# Altium project Node-IOT.PrjPcb
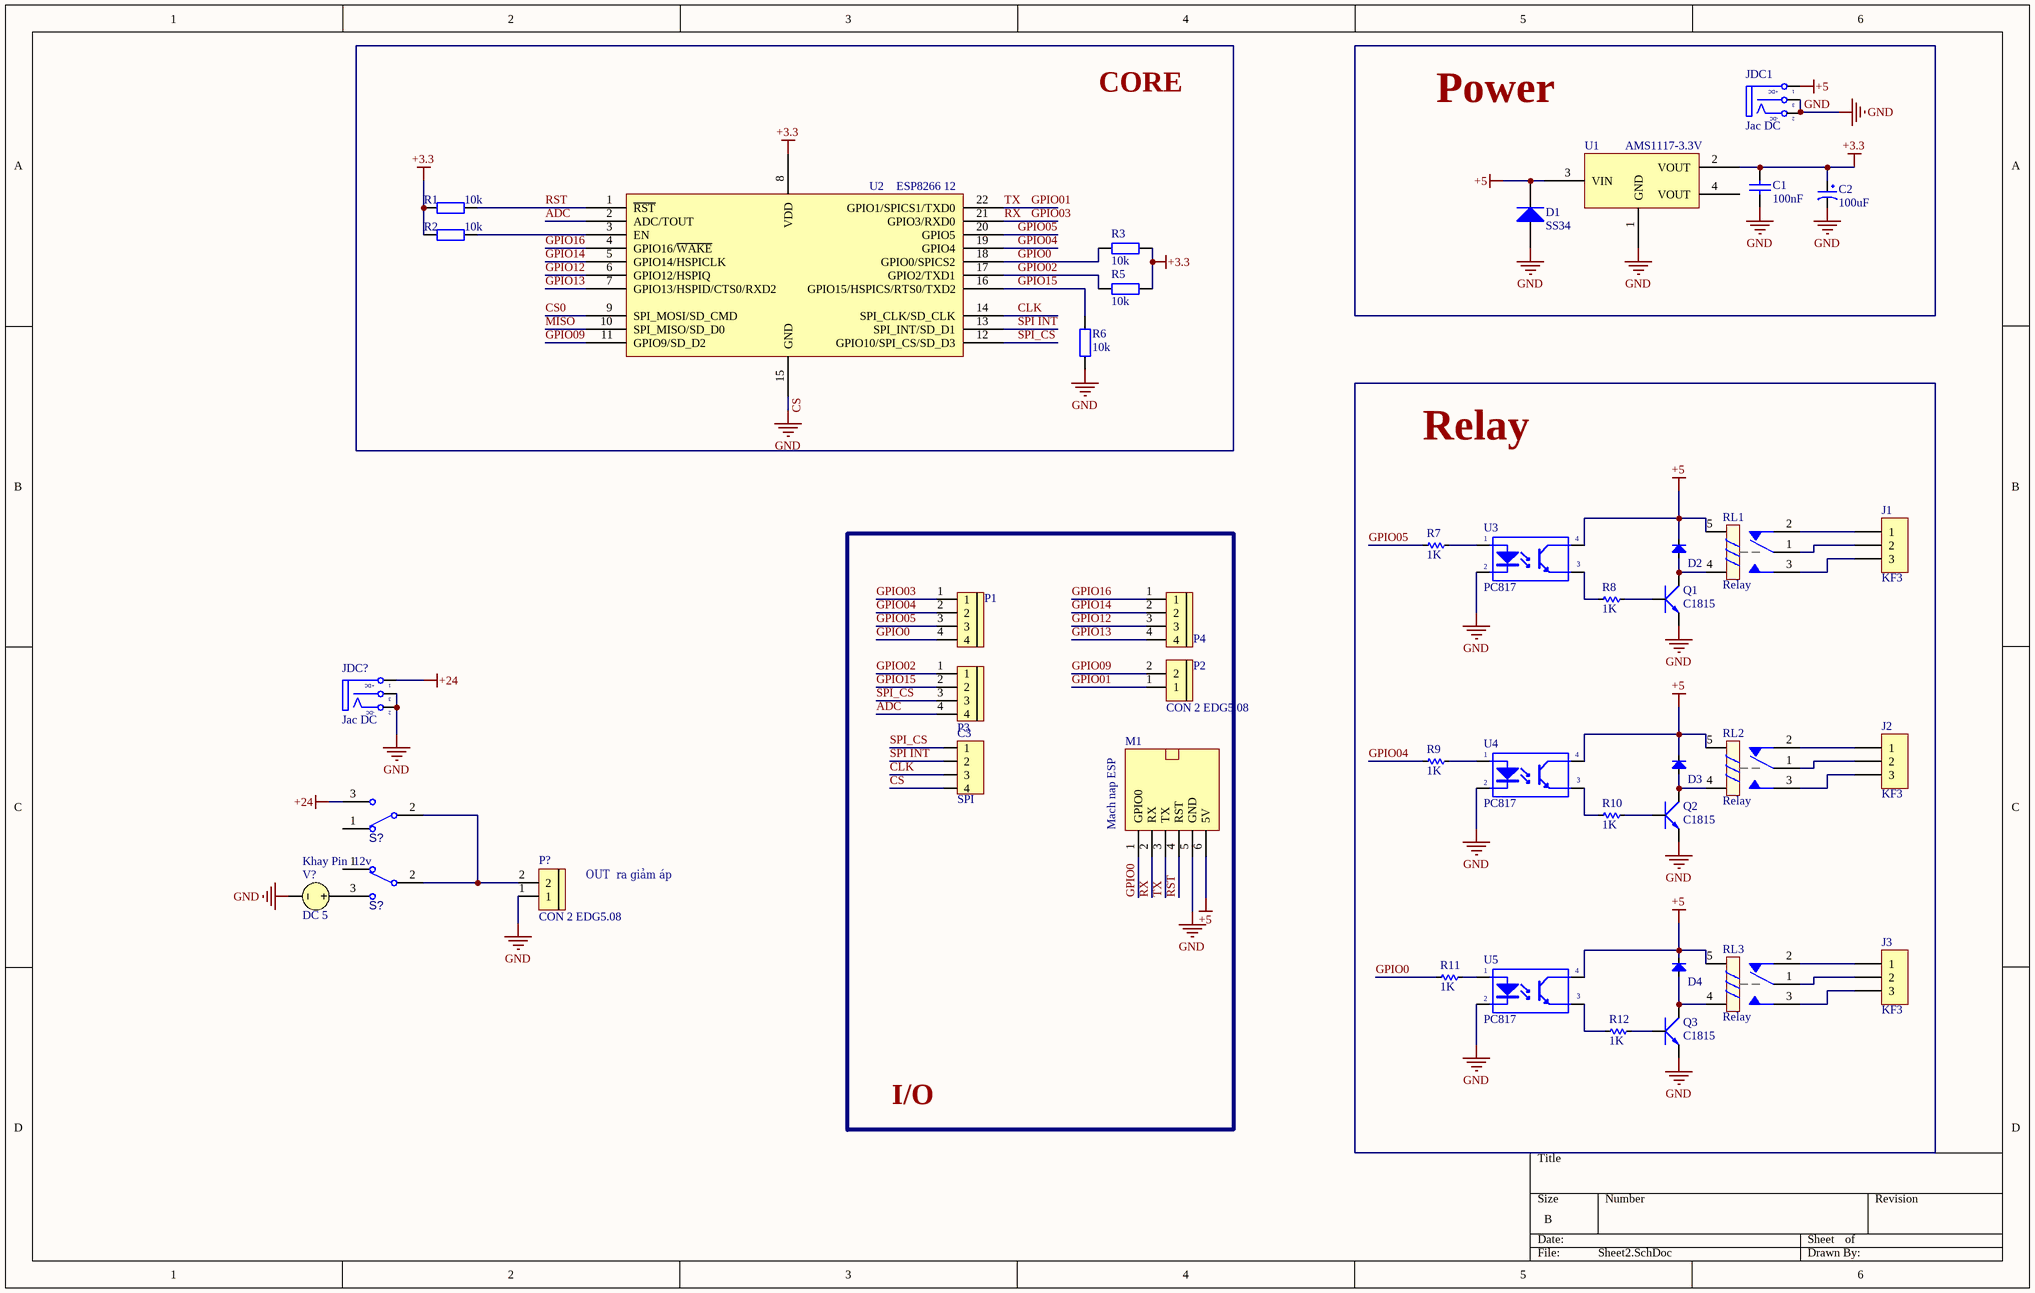
[diagram p0: Sheet2.SchDoc]
1 sheet, 43 parts. Net scope: global (net labels, ports and power ports of the same name join across sheets).
Board file: PCB2.PcbDoc

## Sheet Sheet2.SchDoc
size B; SheetNumber: 1; SheetTotal: 1

### Parts
(Parts that share a designator on the sheet are numbered #1, #2 ... from top to bottom, then left to right.)
C1  100nF  [tu 0805]
C2  100uF  [tu tantalum smd3528]
C3  SPI  [HDR4]
D1  SS34  [DIODE SMA]
D2  Diode  [DIO-1A]  (value not drawn)
D3  Diode  [DIO-1A]  (value not drawn)
D4  Diode  [DIO-1A]  (value not drawn)
J1  KF3  [KF3-5.08]
J2  KF3  [KF3-5.08]
J3  KF3  [KF3-5.08]
JDC1  Jac DC  [DC0]
JDC?  Jac DC  [DC0]
M1  Mach nap ESP  [MACH NAP ESP]
P1  CON 4 EDG5.08  [CON 4 4EDG5.08]  (value not drawn)
P2  CON 4 EDG5.08  [CON 4 4EDG5.08]  (value not drawn)
P3  CON 4 EDG5.08  [CON 4 4EDG5.08]  (value not drawn)
P4  CON 2 EDG5.08  [CON 2 2EDG5.08]
P?  CON 2 EDG5.08  [CON 2 2EDG5.08]
Q1  C1815  [TO92]
Q2  C1815  [TO92]
Q3  C1815  [TO92]
R1  10k  [tro smd 0805]
R2  10k  [tro smd 0805]
R3  10k  [tro smd 0805]
R5  10k  [tro smd 0805]
R6  10k  [tro smd 0805]
R7  1K  [RES-1/2W]
R8  1K  [RES-1/2W]
R9  1K  [RES-1/2W]
R10  1K  [RES-1/2W]
R11  1K  [RES-1/2W]
R12  1K  [RES-1/2W]
RL1  Relay  [Relay 5 Chan SRD]
RL2  Relay  [Relay 5 Chan SRD]
RL3  Relay  [Relay 5 Chan SRD]
S?#1  SW_THD_SPDT  [SWITCH SPDT 1P2T 2mm]  (value not drawn)
S?#2  SW_THD_SPDT  [SWITCH SPDT 1P2T 2mm]  (value not drawn)
U1  AMS1117-3.3V  [SOT223]
U2  ESP8266 12  [ESP8266 12]
U3  PC817  [DIP4]
U4  PC817  [DIP4]
U5  PC817  [DIP4]
V?  DC 5

### Nets
+3.3: C1.1 C2.1 R1.2 R2.2 R3.2 R5.2 U1.2(VOUT) U2.8(VDD)
+5: D1.2(K) D2.2(K) D3.2(K) D4.2(K) JDC1.1(T) M1.6(5V) RL1.5 RL2.5 RL3.5 U1.3(VIN) U3.4(C) U4.4(C) U5.4(C)
+24: JDC?.1(T) S?#1.3
CS: C1.2 C2.2 C3.4 D1.1(A) JDC1.2(TN) JDC1.3(S) JDC?.2(TN) JDC?.3(S) M1.5(GND) P?.1 Q1.1(E) Q2.1(E) Q3.1(E) R6.1 U1.1(GND) U2.15(GND) U3.2(K) U4.2(K) U5.2(K) V?.2  [also labelled GND]
ADC: P3.4 U2.2(ADC/TOUT)
CLK: C3.3 U2.14(SPI_CLK/SD_CLK)
CS0: U2.9(SPI_MOSI/SD_CMD)
GPIO0: M1.1(GPIO0) P1.4 R3.1 R11.2 U2.18(GPIO0/SPICS2)
GPIO01: M1.3(TX) P4.1 U2.22(GPIO1/SPICS1/TXD0)  [also labelled TX]
GPIO02: P3.1 R5.1 U2.17(GPIO2/TXD1)
GPIO03: M1.2(RX) P1.1 U2.21(GPIO3/RXD0)  [also labelled RX]
GPIO04: P1.2 R9.2 U2.19(GPIO4)
GPIO05: P1.3 R7.2 U2.20(GPIO5)
GPIO09: P4.2 U2.11(GPIO9/SD_D2)
GPIO12: P2.3 U2.6(GPIO12/HSPIQ)
GPIO13: P2.4 U2.7(GPIO13/HSPID/CTS0/RXD2)
GPIO14: P2.2 U2.5(GPIO14/HSPICLK)
GPIO15: P3.2 R6.2 U2.16(GPIO15/HSPICS/RTS0/TXD2)
GPIO16: P2.1 U2.4(GPIO16/~{WAKE})
MISO: U2.10(SPI_MISO/SD_D0)
RST: M1.4(RST) R1.1 U2.1(~{RST})
SPI INT: C3.2 U2.13(SPI_INT/SD_D1)
SPI_CS: C3.1 P3.3 U2.12(GPIO10/SPI_CS/SD_D3)
NetD2_1: D2.1(A) Q1.2(C) RL1.4
NetD3_1: D3.1(A) Q2.2(C) RL2.4
NetD4_1: D4.1(A) Q3.2(C) RL3.4
NetJ1_1: J1.1 RL1.2
NetJ1_2: J1.2 RL1.1
NetJ1_3: J1.3 RL1.3
NetJ2_1: J2.1 RL2.2
NetJ2_2: J2.2 RL2.1
NetJ2_3: J2.3 RL2.3
NetJ3_1: J3.1 RL3.2
NetJ3_2: J3.2 RL3.1
NetJ3_3: J3.3 RL3.3
NetP?_2: P?.2 S?#1.2 S?#2.2
NetQ1_3: Q1.3(B) R8.1
NetQ2_3: Q2.3(B) R10.1
NetQ3_3: Q3.3(B) R12.1
NetR2_1: R2.1 U2.3(EN)
NetR7_1: R7.1 U3.1(A)
NetR8_2: R8.2 U3.3(E)
NetR9_1: R9.1 U4.1(A)
NetR10_2: R10.2 U4.3(E)
NetR11_1: R11.1 U5.1(A)
NetR12_2: R12.2 U5.3(E)
NetS?#2_3: S?#2.3 V?.1

Not connected (* = marked no-connect by the designer): S?#1 1; S?#2 1; U1 4(VOUT)

### Notes on the sheet
- CORE
- Power
- Relay
- (near V?) Khay Pin  12v
- (near P?) OUT  ra giảm áp
- I/O
- (in symbol DCIN) +DC; -DC

### Library data of the parts
C1 = Tu 0805 221 50V: Dán; Don_Vi: Con; So_Chan: 2; Ten_Linh_Kien: Tụ 0805 221-220P 50V; Ma_Hang: MH007365; Chung_Loai: Dán; Kieu_Chan: *
C2 = Tu tantalum 100uF 6.3V SMD3528: Tu Tantalum SMD3528; Chung_Loai: Dán; Don_Vi: Con; So_Chan: 2; Ten_Linh_Kien: Tụ tantalum 107J-100uF 6.3V SMD3528; Ma_Hang: MH007595; Kieu_Chan: *
C3 = Header4: Header IDC, 4 x 1 Pin Vertical 2.54mm Pitch (Non-Boxed, Male); Manufacturer: W¨¹rth Elektronik eiSos GmbH; partNo: 613002143121; ComponentLink1 Description: Manufacturer; ComponentLink2 Description: Datasheet; NoPins: 02; Created Date: 29 March 2013; ComponentLink1URL: http://www.we-online.com; ComponentLink2URL: http://katalog.we-online.de/em/datasheet/6130xx143121.pdf; Created by: Karrer Zheng
D1 = Diode SS34 ( 1N5822 ): Dán; Don_Vi: Con; Ma_Hang: MH002104; Ten_Linh_Kien: Diode SS34 3A 40V SMA ( 1N5822 SS34A); Kieu_Chan: *; Chung_Loai: Dán
D2-D4 = Diode: Default Diode; Code - JEDEC: DO-214-AB; Value: 1N5007; Published: 8-Jun-2000; Revision: July-2002: Re-released for DXP Platform.; Publisher: Altium Limited
J1-J3 = KF3: Manufacturer: Würth Elektronik eiSos GmbH; partNo: 691103110003; ComponentLink1 Description: Manufacturer; ComponentLink2 Description: Datasheet; NoPins: 3; Created Date: 29 October 2013; ComponentLink1URL: http://www.we-online.com; ComponentLink2URL: http://katalog.we-online.de/em/datasheet/6911031100xx.pdf; Created by: Karrer Zheng
JDC1 JDC? = DCIN: Jac DC input; Value: Jac DC
P1-P3 = CON 4 EDG5.08: Cắm; Ten_Linh_Kien: CON 4 2EDG5.08-4P 5.08MM ( Xanh Cong); Ma_Hang: MH000979; Don_Vi: Con; Ghi_Chu: *; Kieu_Chan: *; Chung_Loai: Cắm
P4 P? = CON 2 EDG5.08: Cắm; Ten_Linh_Kien: CON 2 2EDG5.08-2P 5.08MM ( Xanh Cong); Ma_Hang: MH000759; Ghi_Chu: *; Don_Vi: Con; Kieu_Chan: *; Chung_Loai: Cắm
Q1-Q3 = Trans C1815 DIP: NPN transistor; Value: C9014
R1-R3 R5 R6 = Tro 0805 5% 12k: Dán; Don_Vi: Con; So_Chan: 2; Ten_Linh_Kien: Trở 0805 5% 12k; Ma_Hang: MH005241; Chung_Loai: Dán; Kieu_Chan: *
R7-R12 = Res: Manufacturer: Generic Components; Class: Passive; SubClass: R; Published: 08/06/2000; Publisher: Altium Hobart Technology Centre
RL1-RL3 = Relay 5 Chan SRD: Relay 5 Chan; Ma_Hang: MH009374; Ten: Relay 5V10A SRD-05VDC-SL-C Chính Hãng
S?#1 S?#2 = SW_THD_SPDT: Switch THD vertical toggle SPDT; Manufacturer 1: TE Connectivity; Manufacturer Part Number 1: SLS121PC04; Contact Rating @ Voltage: 0.25A @ 125VAC; SCDType: spec; Circuit: SPDT; Mounting Type: PCB mount; Supplier 1: Digi-Key; Supplier Part Number 1: 450-1598-ND
U1 = AMS1117 SMD: Dán; Value: AMS1117-3.3V SOT223; Don_Vi: Con; Ma_Hang: MH000596; Ghi_Chu: *; Kieu_Chan: *; Chung_Loai: Dán
U2 = ESP8266 12: ESP8266 12 22 Pin; IC: ESP8266-EX; Vendor: Ai-thinker
U3-U5 = PC817: Single Opto; Value: PC817
V? = VSRC: Voltage Source; Note: PCB Footprint - Not required; AC Magnitude: 1; AC Phase: 0; Value: 5; Published: 8-Jun-2000; LatestRevisionDate: 17-Jul-2002; LatestRevisionNote: Re-released for DXP Platform.; PackageReference: Not Applicable; Publisher: Altium Limited
M1 = Mach nap ESP: ComponentLink1Description: Datasheet; ComponentLink1URL: https://linhkienthuduc.com/san-pham/usb-uart-ch340-kiem-mach-nap-esp32-esp8266-cong-type-c-v1/